# EAGLE design FlightCPU (EAGLE 6.6.0)
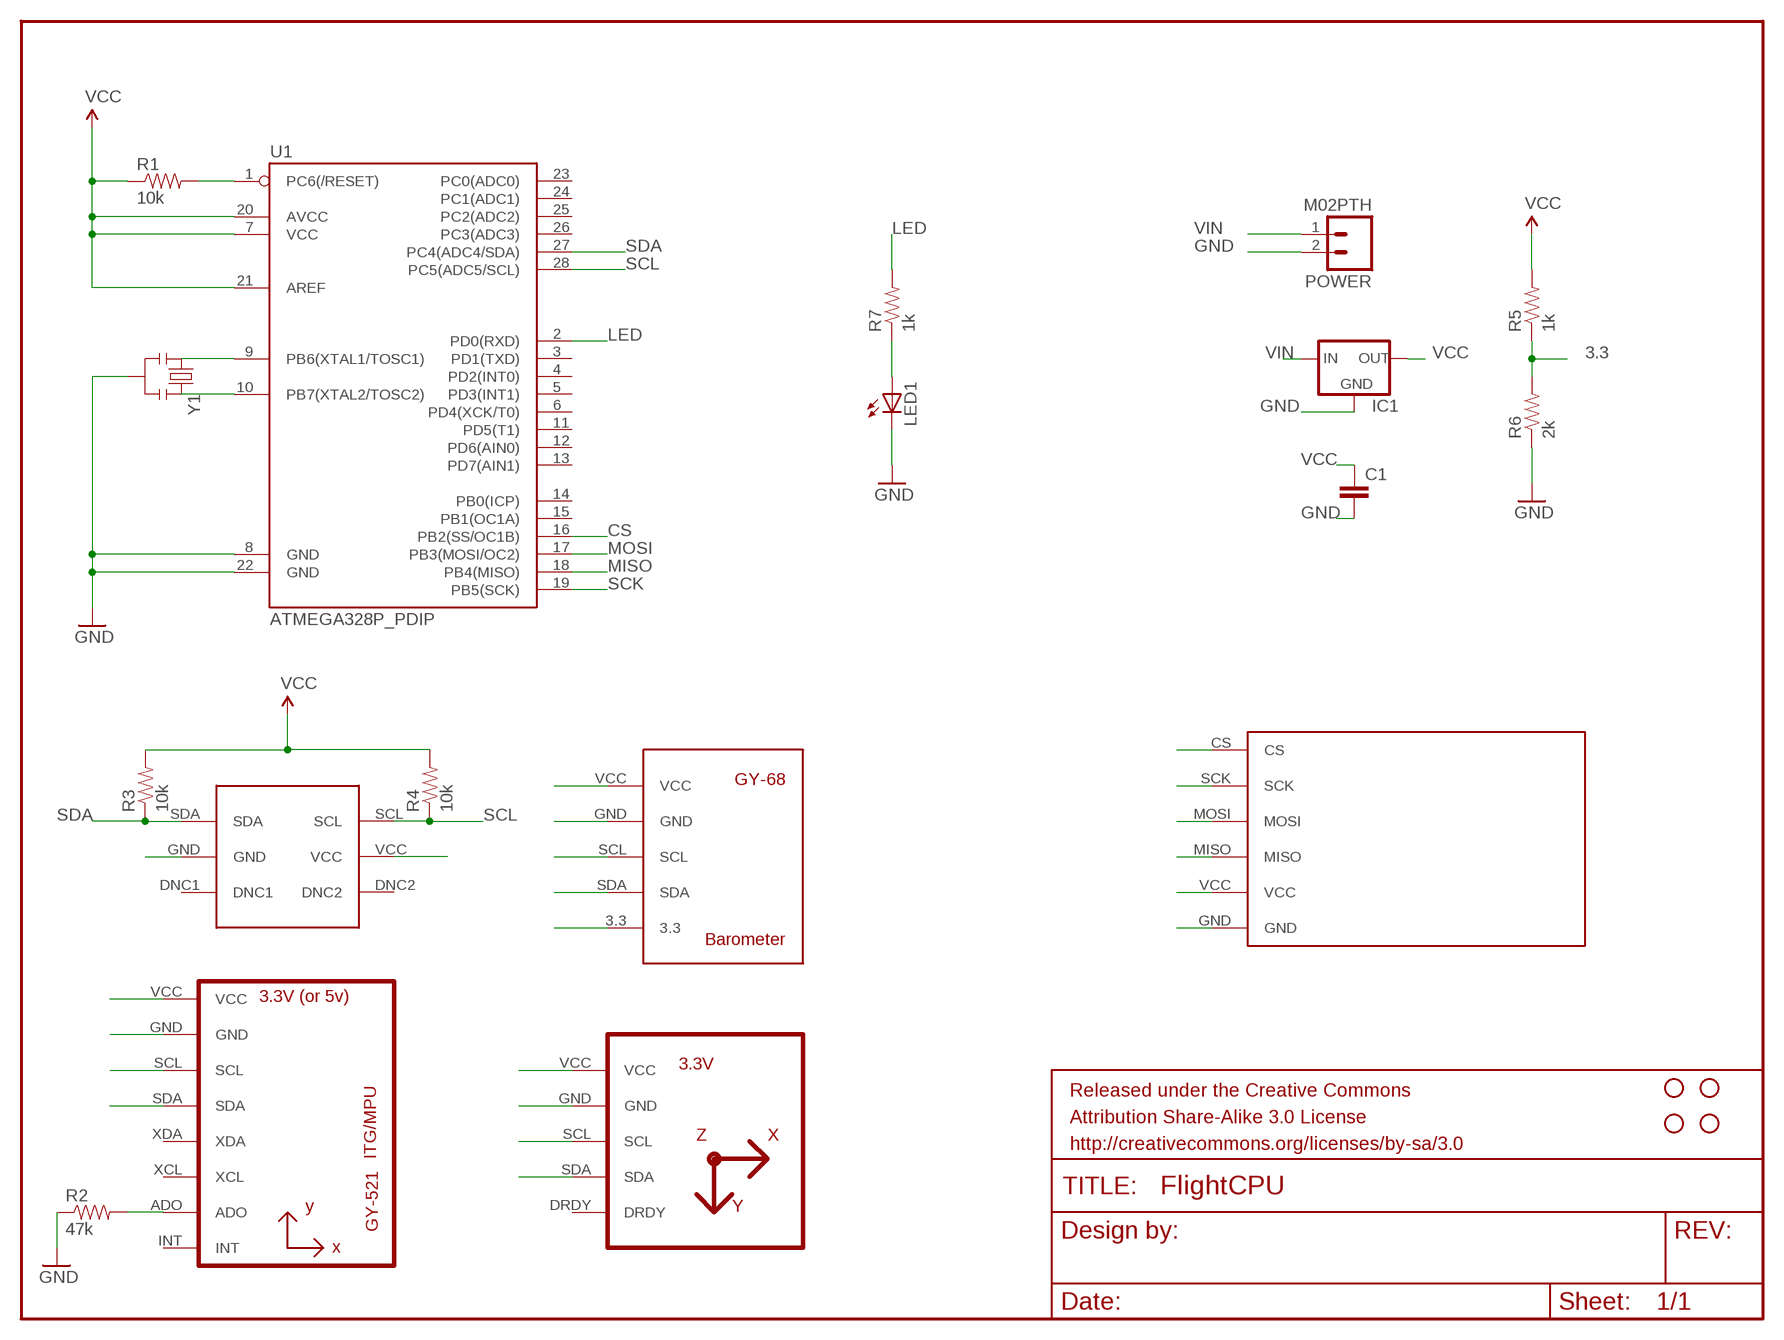
[diagram p0: schematic, sheet 1]

## Parts
C1  CAPKIT  [CAP-PTH-SMALL-KIT]
FRAME1  FRAME-LETTER  [CREATIVE_COMMONS]
IC1  V_REG_78XXSIDE  [78XXL]
LED1  LED3MM  [LED3MM]
POWER  M02PTH  [1X02]
R1  10k  RESISTORAXIAL-0.3  [AXIAL-0.3]
R2  47k  RESISTORAXIAL-0.3  [AXIAL-0.3]
R3  10k  RESISTORAXIAL-0.3  [AXIAL-0.3]
R4  10k  RESISTORAXIAL-0.3  [AXIAL-0.3]
R5  1k  RESISTORAXIAL-0.3  [AXIAL-0.3]
R6  2k  RESISTORAXIAL-0.3  [AXIAL-0.3]
R7  1k  RESISTORAXIAL-0.3  [AXIAL-0.3]
STANDOFF1  STAND-OFF  [STAND-OFF]
STANDOFF2  STAND-OFF  [STAND-OFF]
STANDOFF3  STAND-OFF  [STAND-OFF]
STANDOFF4  STAND-OFF  [STAND-OFF]
U1  ATMEGA328P_PDIP  [DIL28-3]
U2  GY-521MPU6050  [GY-521]
U3  HMC5883LGY-271  [GY-271]
U$1  SI7020_DIP  [SI7020]
U$2  GY-68  [GY-68]
U$3  MICRO_SD  [MICROSD]
Y1  RESONATORPTH  [RESONATOR-PTH]

## Nets
3.3: R5.P$1 R6.P$2 U$2.3.3
CS: U1.16(PB2(SS/OC1B)) U$3.CS
GND: C1.2 IC1.GND LED1.K(C) POWER.2 R2.P$1 R6.P$1 U1.8(GND) U1.22(GND) U2.GND U3.GND U$1.GND U$2.GND U$3.GND Y1.2
LED: R7.P$2 U1.2(PD0(RXD))
MISO: U1.18(PB4(MISO)) U$3.MISO
MOSI: U1.17(PB3(MOSI/OC2)) U$3.MOSI
N$1: R1.P$2 U1.1(PC6(/RESET))
N$2: U1.9(PB6(XTAL1/TOSC1)) Y1.1
N$3: U1.10(PB7(XTAL2/TOSC2)) Y1.3
N$4: LED1.A R7.P$1
N$12: R2.P$2 U2.ADO
SCK: U1.19(PB5(SCK)) U$3.SCK
SCL: R4.P$1 U1.28(PC5(ADC5/SCL)) U2.SCL U3.SCL U$1.SCL U$2.SCL
SDA: R3.P$1 U1.27(PC4(ADC4/SDA)) U2.SDA U3.SDA U$1.SDA U$2.SDA
VCC: C1.1 IC1.OUT R1.P$1 R3.P$2 R4.P$2 R5.P$2 U1.7(VCC) U1.20(AVCC) U1.21(AREF) U2.VCC U3.VCC U$1.VCC U$2.VCC U$3.VCC
VIN: IC1.IN POWER.1
Unconnected: U1.3(PD1(TXD)) U1.4(PD2(INT0)) U1.5(PD3(INT1)) U1.6(PD4(XCK/T0)) U1.11(PD5(T1)) U1.12(PD6(AIN0)) U1.13(PD7(AIN1)) U1.14(PB0(ICP)) U1.15(PB1(OC1A)) U1.23(PC0(ADC0)) U1.24(PC1(ADC1)) U1.25(PC2(ADC2)) U1.26(PC3(ADC3)) U2.INT U2.XCL U2.XDA U3.DRDY U$1.DNC1 U$1.DNC2

## Library data of the parts
C1 = EmmaTech:CAP: Capacitor Standard 0603 ceramic capacitor, and 0.1" leaded capacitor.
FRAME1 = SparkFun-Aesthetics:FRAME-LETTER: Schematic Frame Standard 8.5x11 US Letter frame
IC1 = EmmaTech:V_REG_78XX: Voltage Regulator Standard 7805 5V regulator. IGO (Input Ground Output). Spark Fun Electronics SKU : COM-00107
LED1 = SparkFun-LED:LED: LEDs Standard schematic elements and footprints for 5mm, 3mm, 1206, and 0603 sized LEDs. 5mm - Spark Fun Electronics SKU : COM-00529 (and others)
POWER = EmmaTech:M02: Standard 2-pin 0.1" header. Use with - straight break away headers ( PRT-00116) - right angle break away headers (PRT-00553) - swiss pins (PRT-00743) - machine pins (PRT-00117) - female headers (PRT-00115) Molex polarized connector foot print use with: PRT-08233 with associated crimp pins and housings. 2.54_SCREWTERM for use with PRT-10571. 3.5mm Screw Terminal footprints for PRT-08084 5mm Screw Terminal footprints for use with PRT-08433
R1-R7 = SparkFun-Resistors:RESISTOR: Resistor Basic schematic elements and footprints for 0603, 1206, and PTH resistors.
STANDOFF1-STANDOFF4 = EmmaTech:STAND-OFF: #4 Stand Off This is the mechanical footprint for a #4 phillips button head screw. Use the keepout ring to avoid running the screw head into surrounding components. SKU : PRT-00447
U1 = SparkFun-DigitalIC:ATMEGA328P_PDIP: uC used in the Arduino 32kb flash, 1k EEPROM, 2k SRAM This is the through-hole version of this chip.
U2 = gy-521:GY-521
U3 = hmc5883l:HMC5883L
U$1 = EmmaTech:SI7020_DIP
U$2 = EmmaTech:GY-68
U$3 = EmmaTech:MICRO_SD
Y1 = EmmaTech:RESONATOR: Resonator Small SMD resonator. Used, eg, on the Arduino Pro/ Pro Mini boards. 8MHz- XTAL-08895 16MHz- XTAL-08900

## Board
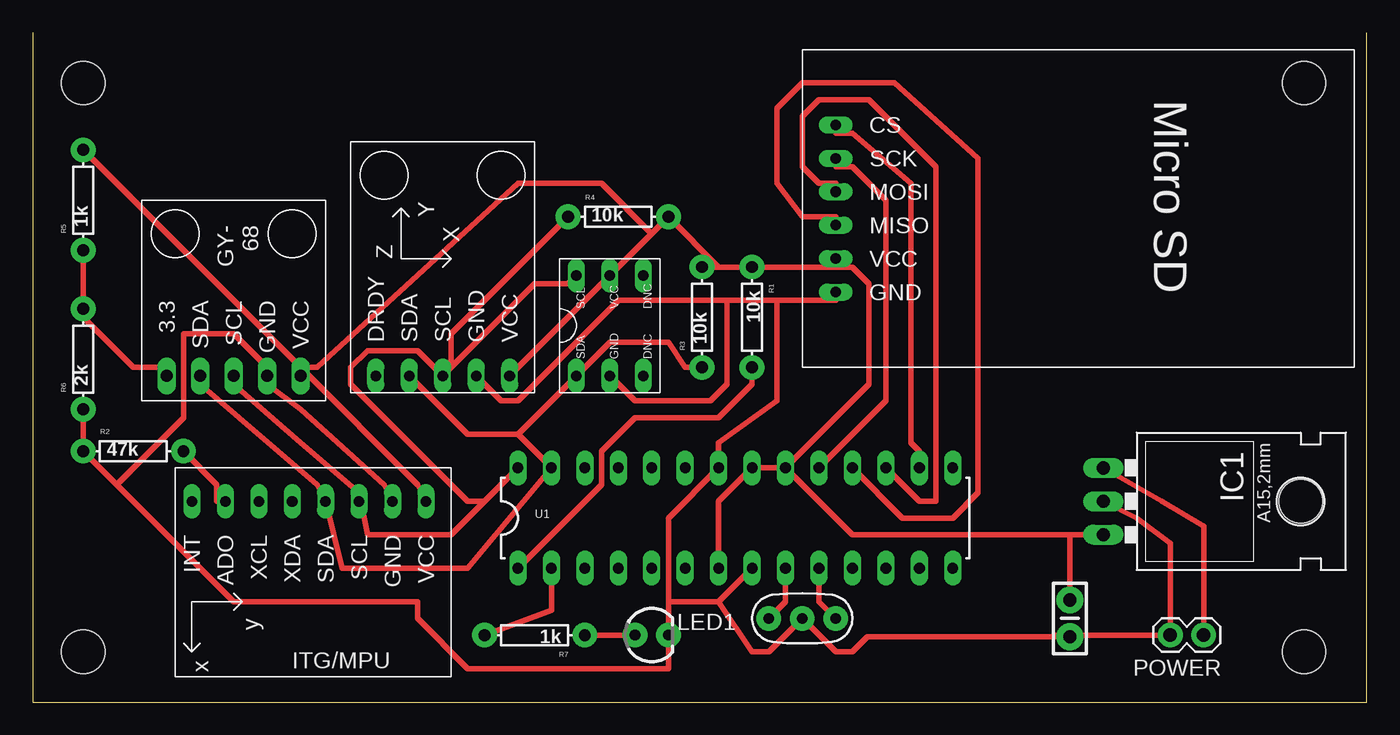
[diagram p1: board, top side]

Size 101.27 x 50.79 mm. Coordinates in mm from the lower left corner, seen from the top.
Outline: 101.27,50.79 101.27,0 0,0 0,50.79
Copper layers (1*16): Top 0.035mm / dielectric 1.5mm / Bottom 0.035mm
Design rules "default": minimum track width 10mil, minimum drill 24mil, track to track 8mil, track to pad 8mil, pad to pad 8mil, via to via 8mil, smd to smd 8mil, copper to edge 40mil, drill to drill 8mil, minimum pad ring 10mil, minimum via ring 8mil, stop-mask expansion 4mil, vias tented up to drill 0mil, thermal gap 10mil

### Footprints (pad centres in the part's own frame; a part is rotated, then mirrored left to right if it is on the bottom)
CAP-PTH-SMALL-KIT = drill 1.016 pad 2.032: 1 -1.397,0; 2 1.397,0
78XXL = drill 1.016 long: GND 0,-3.81; IN -2.54,-3.81; OUT 2.54,-3.81 | hole 3.302: 0,11.176
LED3MM = drill 0.813 pad 1.88: A -1.27,0; K 1.27,0
1X02 = drill 1.016 pad 1.88: 1 0,0; 2 2.54,0
AXIAL-0.3 = drill 0.9 pad 1.88: P$1 -3.81,0; P$2 3.81,0
STAND-OFF = hole 3.302: 0,0
DIL28-3 = drill 0.813 long: 1 -16.51,-3.81; 2 -13.97,-3.81; 3 -11.43,-3.81; 4 -8.89,-3.81; 5 -6.35,-3.81; 6 -3.81,-3.81; 7 -1.27,-3.81; 8 1.27,-3.81; 9 3.81,-3.81; 10 6.35,-3.81; 11 8.89,-3.81; 12 11.43,-3.81; 13 13.97,-3.81; 14 16.51,-3.81; 15 16.51,3.81; 16 13.97,3.81; 17 11.43,3.81; 18 8.89,3.81; 19 6.35,3.81; 20 3.81,3.81; 21 1.27,3.81; 22 -1.27,3.81; 23 -3.81,3.81; 24 -6.35,3.81; 25 -8.89,3.81; 26 -11.43,3.81; 27 -13.97,3.81; 28 -16.51,3.81
GY-521 = drill 0.8 long: ADO -8.89,-6.35; GND -8.89,6.35; INT -8.89,-8.89; SCL -8.89,3.81; SDA -8.89,1.27; XCL -8.89,-3.81; XDA -8.89,-1.27 | drill 0.8 pad 1.27 long: VCC -8.89,8.89
GY-271 = drill 0.8 long: DRDY -6.35,5.715; GND -6.35,-1.905; SCL -6.35,0.635; SDA -6.35,3.175; VCC -6.35,-4.445
SI7020 = drill 0.8 long: DNC1 1.27,1.27; DNC2 8.89,1.27; GND 1.27,3.81; SCL 8.89,6.35; SDA 1.27,6.35; VCC 8.89,3.81
GY-68 = drill 0.9 long: 3.3 13.335,1.905; GND 13.335,9.525; SCL 13.335,6.985; SDA 13.335,4.445; VCC 13.335,12.065
MICROSD = drill 0.8 long: CS 2.54,18.415; GND 2.54,5.715; MISO 2.54,10.795; MOSI 2.54,13.335; SCK 2.54,15.875; VCC 2.54,8.255
RESONATOR-PTH = drill 0.8 pad 1.88: 1 -2.54,0; 2 0,0; 3 2.54,0

### Placement (x,y rotation side)
C1  78.74,6.35 270 top
FRAME1  29.21,55.88 0 top  (outside the outline)
IC1  85.09,15.24 270 top
LED1  46.99,5.08 0 top
POWER  88.9,5.08 180 top
R1  54.61,29.21 270 top
R2  7.62,19.05 0 top
R3  50.8,29.21 90 top
R4  44.45,36.83 0 top
R5  3.81,38.1 90 top
R6  3.81,26.04 90 top
R7  38.1,5.08 180 top
STANDOFF1  3.81,3.81 0 top
STANDOFF2  96.52,46.99 0 top
STANDOFF3  3.81,46.99 0 top
STANDOFF4  96.52,3.81 0 top
U1  53.34,13.97 0 top
U2  20.95,6.35 270 top
U3  31.75,31.11 90 top
U$1  47.62,23.5 90 top
U$2  8.26,38.1 270 top
U$3  58.42,25.4 0 top
Y1  58.42,6.35 0 top

### Tracks (layer width: path | path; a pad name or v marks a point on that pad's centre or on a via)
3.3
  Top 0.406: U$2.3.3 10.16,25.4 7.62,25.4 3.81,29.21 R6.P$2 R5.P$1
CS
  Top 0.406: U$3.CS 60.96,43.18 62.23,43.18 66.67,39.37 66.67,19.68 67.31,19.05 U1.16
GND
  Top 0.406: U3.GND 35.56,22.86 36.83,22.86 44.45,30.48 52.7,30.48 | 56.52,30.48 60.96,30.48 U$3.GND | 56.52,30.48 52.7,30.48 | U$1.GND 45.72,22.86 51.44,22.86 52.7,24.13 52.7,30.48 | 56.52,30.48 56.52,22.86 52.07,19.68 U1.22 48.26,13.97 48.26,7.62 | U2.GND 26.67,16.51 20.32,22.23 17.78,24.13 U$2.GND 17.78,25.4 15.24,27.94 11.43,27.94 11.43,21.59 6.35,16.51 | R6.P$1 R2.P$1 6.35,16.51 | 6.35,16.51 15.24,7.62 29.21,7.62 29.21,6.35 33.02,2.54 48.26,2.54 LED1.K 48.26,7.62 | 52.07,7.62 48.26,7.62 | IC1.GND 83.82,13.97 86.36,12.06 POWER.2 77.6,5.08 C1.2 63.37,4.95 62.23,3.81 60.96,3.81 Y1.2 55.88,3.81 54.61,3.81 52.07,7.62 | 52.07,7.62 U1.8
LED
  Top 0.406: U1.2 39.37,6.99 R7.P$2
MISO
  Top 0.406: U1.18 66.04,13.97 69.85,13.97 71.75,15.88 71.75,41.27 65.41,46.99 58.42,46.99 56.52,45.09 56.52,39.37 58.42,36.83 60.96,36.83 U$3.MISO
MOSI
  Top 0.406: U1.17 67.31,15.24 68.58,15.24 68.58,40.64 63.5,45.72 59.69,45.72 58.42,44.45 58.42,40.64 59.69,39.37 60.96,39.37 U$3.MOSI
N$1
  Top 0.406: U1.1 43.18,16.51 43.18,19.05 45.72,21.59 52.07,21.59 54.61,24.13 R1.P$2
N$2
  Top 0.406: U1.9 57.15,7.62 Y1.1
N$3
  Top 0.406: U1.10 59.69,7.62 Y1.3
N$4
  Top 0.406: LED1.A R7.P$1
N$12
  Top 0.406: R2.P$2 13.97,16.51 13.97,15.24 U2.ADO
SCK
  Top 0.406: U1.19 64.77,22.86 64.77,38.1 62.23,40.64 60.96,40.64 U$3.SCK
SCL
  Top 0.406: 31.75,25.4 38.1,31.75 40.64,31.75 U$1.SCL | 34.29,15.24 31.75,12.7 25.4,12.7 24.77,15.88 | 34.29,15.24 U1.28 | 24.77,15.88 20.32,19.68 15.24,24.13 U$2.SCL | 24.77,15.88 U2.SCL | 34.29,15.24 33.02,15.24 24.13,24.13 24.13,25.4 25.4,26.67 29.21,26.67 U3.SCL 31.75,25.4 | 31.75,25.4 31.75,27.94 R4.P$1
SDA
  Top 0.406: U$2.SDA 12.7,24.13 21.59,16.51 U2.SDA 23.5,10.16 33.02,10.16 U1.27 36.83,20.32 | U3.SDA 33.02,20.32 36.83,20.32 | 36.83,20.32 U$1.SDA 43.81,27.3 48.26,27.3 49.53,25.4 R3.P$1
VCC
  Top 0.406: R5.P$2 20.32,25.4 | 20.32,25.4 29.21,16.51 U2.VCC | 60.96,33.02 R1.P$1 52.07,33.02 | 52.07,33.02 R3.P$2 | U3.VCC U$1.VCC 46.99,35.56 | U1.7 52.07,15.24 U1.21 U1.20 | U1.20 62.23,12.7 78.74,12.7 | 60.96,33.02 62.23,33.02 63.5,31.75 63.5,24.13 U1.20 | 60.96,33.02 U$3.VCC | 20.32,25.4 21.59,25.4 36.83,39.37 43.18,39.37 46.99,35.56 | 20.32,25.4 U$2.VCC | 78.74,12.7 IC1.OUT | 78.74,12.7 C1.1 78.74,7.62 | 46.99,35.56 R4.P$2 52.07,33.02
VIN
  Top 0.406: IC1.IN 85.72,15.24 88.9,13.34 POWER.1

### Text on the board
Document: 4.12.16 | HAB | COPE | v1.0 | FlightCPU